# Altium schematic sheet HB_PowerSupply.SchDoc
size A4
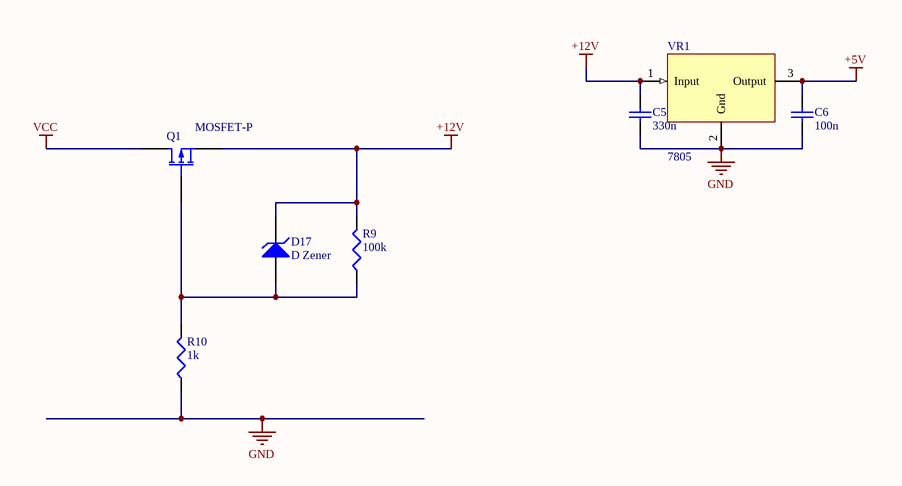
[diagram p0: HB_PowerSupply.SchDoc]

## Parts
C5  value 330n  [C1206]  (hidden comment: Cap_330n)
C6  value 100n  [C1206]  (hidden comment: Cap_100n)
D17  D Zener  [SOD-123]
Q1  MOSFET-P  [TO-220-AB]
R9  value 100k  [6-0805_L]  (hidden comment: Res_100k)
R10  value 1k  [6-0805_L]  (hidden comment: Res_1k)
VR1  7805  [TO-220AB]

## Nets
+5V: C6.1 VR1.3(Output)
+12V: C5.1 D17.1(K) Q1.S R9.2 VR1.1(Input)
GND: C5.2 C6.2 R10.1 VR1.2(Gnd)
VCC: Q1.D
NetD17_2: D17.2(A) Q1.G R9.1 R10.2

## Library data of the parts
C5 = Cap_330n: Condensateur; Supplier: Farnell  2320905; Designer: ECAM 2004
C6 = Cap_100n: Condensateur; Supplier: Farnell  2534095; Designer: ECAM 2004
D17 = D Zener: Zener Diode; Published: 8-Jun-2000; LatestRevisionDate: 17-Jul-2002; LatestRevisionNote: Re-released for DXP Platform.; PackageReference: DIODE-0.7; Publisher: Altium Limited; PackageDescription: Diode, Thru-Hole; 2 Leads; 0.7 in Pin Spacing; Supplier: RS 687-8146
Q1 = MOSFET-P: P-Channel MOSFET; Published: 8-Jun-2000; LatestRevisionDate: 17-Jul-2002; LatestRevisionNote: Re-released for DXP Platform.; PackageVersion: 1995/1996; PackageReference: E3; Publisher: Altium Limited; PackageDescription: TO, Flat Index; 3 In-Line, Axial Leads; Body Dia. 4.6mm; Lead Dia. 0.5 mm (max); Supplier: RS 760-4246
R9 = Res_100k: Résistance standard; Designer: ECAM 2005; Supplier: RS 740-8802; Type: Résistance standard
R10 = Res_1k: Résistance standard; Designer: ECAM 2005; Supplier: RS 566-800; Type: Résistance standard
VR1 = 7805: Régulateur 5V; Supplier: RS 536-0969; Designer: ECAM 2004; Type: 7805